# EAGLE design extension_board_0_2 (EAGLE 6.5.0)

## Sheet 1 of 4: Header
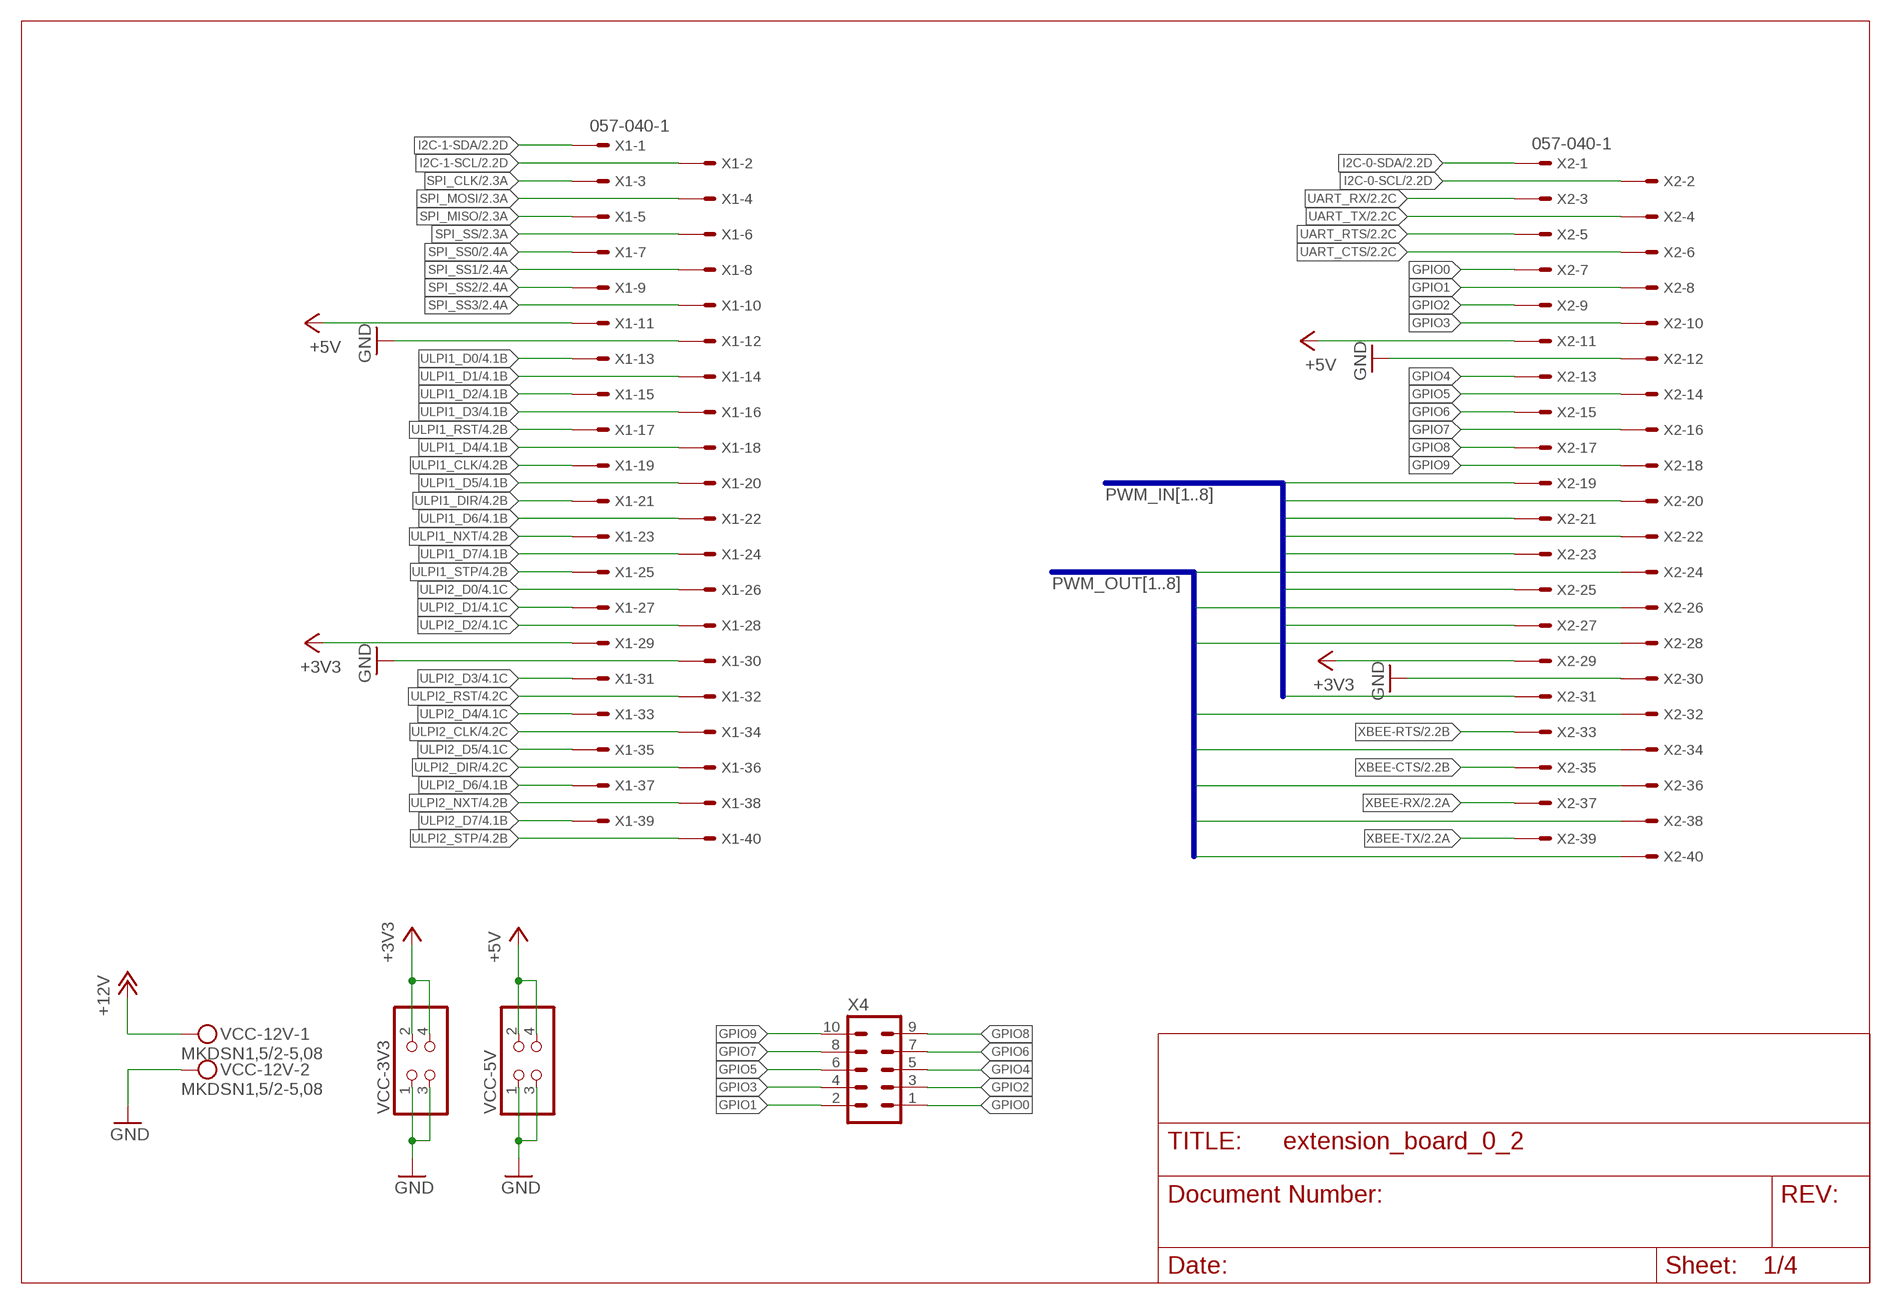
[diagram p0: schematic, sheet 1]

### Parts
VCC-3V3  PINHD-2X2  [2X02]
VCC-5V  PINHD-2X2  [2X02]
VCC-12V  MKDSN1,5/2-5,08  [MKDSN1,5/2-5,08]
X1  057-040-1  [057-040-1]
X2  057-040-1  [057-040-1]
X4  MA05-2  [MA05-2]

### Nets
+3V3: VCC-3V3.2 VCC-3V3.4 X1.29 X2.29 ; also sheet 2,4
+5V: VCC-5V.2 VCC-5V.4 X1.11 X2.11 ; also sheet 2,4
+12V: VCC-12V.1 ; also sheet 3
GND: VCC-3V3.1 VCC-3V3.3 VCC-5V.1 VCC-5V.3 VCC-12V.2 X1.12 X1.30 X2.12 X2.30 ; also sheet 2,3,4
GPIO0: X2.7 X4.1
GPIO1: X2.8 X4.2
GPIO2: X2.9 X4.3
GPIO3: X2.10 X4.4
GPIO4: X2.13 X4.5
GPIO5: X2.14 X4.6
GPIO6: X2.15 X4.7
GPIO7: X2.16 X4.8
GPIO8: X2.17 X4.9
GPIO9: X2.18 X4.10
I2C-0-SCL: X2.2 ; also sheet 2
I2C-0-SDA: X2.1 ; also sheet 2
I2C-1-SCL: X1.2 ; also sheet 2
I2C-1-SDA: X1.1 ; also sheet 2
PWM_IN1: X2.19 ; also sheet 2
PWM_IN2: X2.20 ; also sheet 2
PWM_IN3: X2.21 ; also sheet 2
PWM_IN4: X2.22 ; also sheet 2
PWM_IN5: X2.23 ; also sheet 2
PWM_IN6: X2.25 ; also sheet 2
PWM_IN7: X2.27 ; also sheet 2
PWM_IN8: X2.31 ; also sheet 2
PWM_OUT1: X2.40 ; also sheet 2
PWM_OUT2: X2.38 ; also sheet 2
PWM_OUT3: X2.36 ; also sheet 2
PWM_OUT4: X2.34 ; also sheet 2
PWM_OUT5: X2.32 ; also sheet 2
PWM_OUT6: X2.28 ; also sheet 2
PWM_OUT7: X2.26 ; also sheet 2
PWM_OUT8: X2.24 ; also sheet 2
SPI_CLK: X1.3 ; also sheet 2
SPI_MISO: X1.5 ; also sheet 2
SPI_MOSI: X1.4 ; also sheet 2
SPI_SS: X1.6 ; also sheet 2
SPI_SS0: X1.7 ; also sheet 2
SPI_SS1: X1.8 ; also sheet 2
SPI_SS2: X1.9 ; also sheet 2
SPI_SS3: X1.10 ; also sheet 2
UART_CTS: X2.6 ; also sheet 2
UART_RTS: X2.5 ; also sheet 2
UART_RX: X2.3 ; also sheet 2
UART_TX: X2.4 ; also sheet 2
ULPI1_CLK: X1.19 ; also sheet 4
ULPI1_D0: X1.13 ; also sheet 4
ULPI1_D1: X1.14 ; also sheet 4
ULPI1_D2: X1.15 ; also sheet 4
ULPI1_D3: X1.16 ; also sheet 4
ULPI1_D4: X1.18 ; also sheet 4
ULPI1_D5: X1.20 ; also sheet 4
ULPI1_D6: X1.22 ; also sheet 4
ULPI1_D7: X1.24 ; also sheet 4
ULPI1_DIR: X1.21 ; also sheet 4
ULPI1_NXT: X1.23 ; also sheet 4
ULPI1_RST: X1.17 ; also sheet 4
ULPI1_STP: X1.25 ; also sheet 4
ULPI2_CLK: X1.34 ; also sheet 4
ULPI2_D0: X1.26 ; also sheet 4
ULPI2_D1: X1.27 ; also sheet 4
ULPI2_D2: X1.28 ; also sheet 4
ULPI2_D3: X1.31 ; also sheet 4
ULPI2_D4: X1.33 ; also sheet 4
ULPI2_D5: X1.35 ; also sheet 4
ULPI2_D6: X1.37 ; also sheet 4
ULPI2_D7: X1.39 ; also sheet 4
ULPI2_DIR: X1.36 ; also sheet 4
ULPI2_NXT: X1.38 ; also sheet 4
ULPI2_RST: X1.32 ; also sheet 4
ULPI2_STP: X1.40 ; also sheet 4
XBEE-CTS: X2.35 ; also sheet 2
XBEE-RTS: X2.33 ; also sheet 2
XBEE-RX: X2.37 ; also sheet 2
XBEE-TX: X2.39 ; also sheet 2

### Buses
PWM_IN[1..8]
PWM_OUT[1..8]

## Sheet 2 of 4: Interfaces
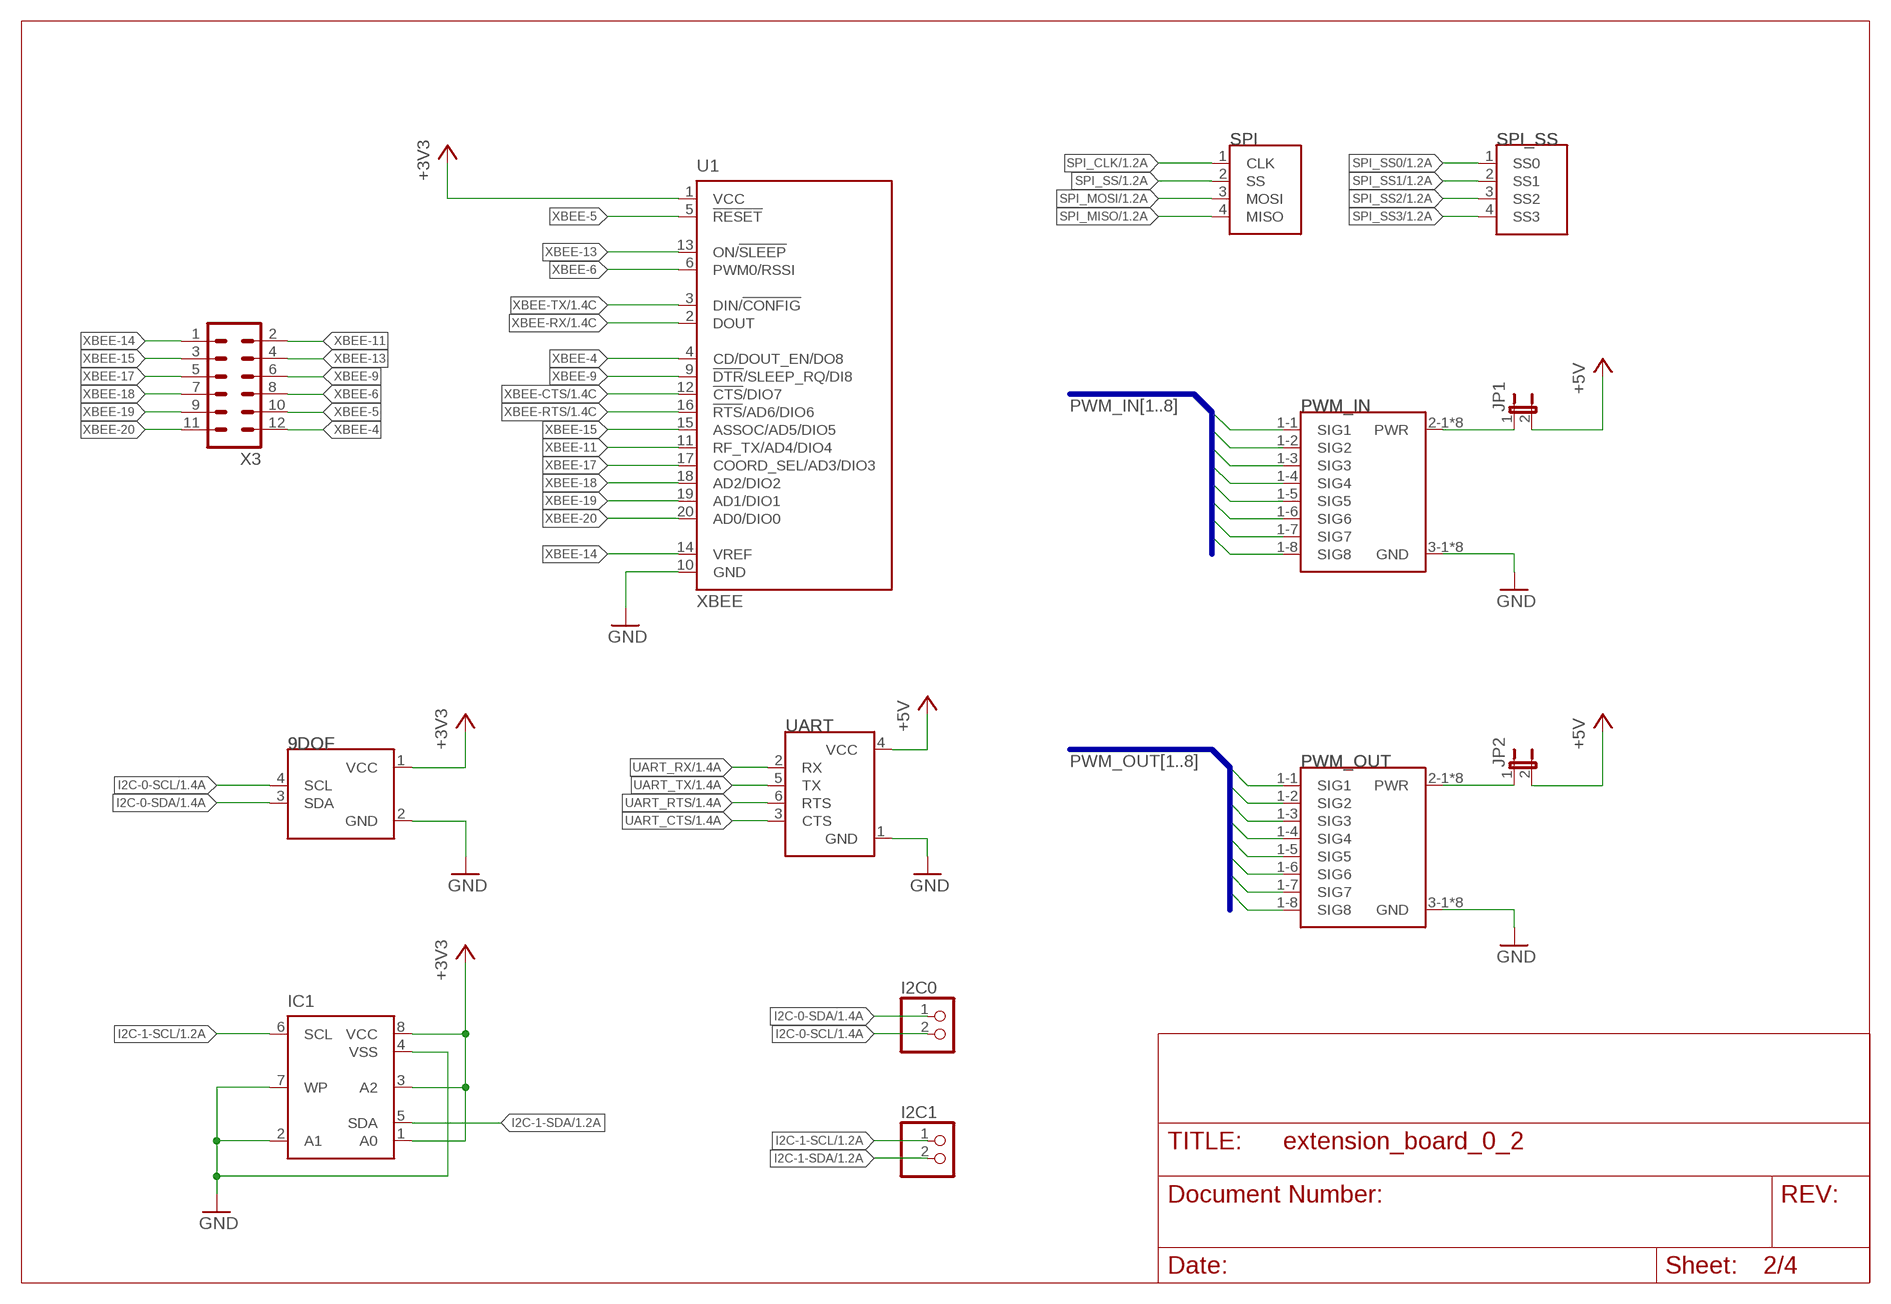
[diagram p1: schematic, sheet 2]

### Parts
9DOF  I2C  [MA04-1]
I2C0  PINHD-1X2  [1X02]
I2C1  PINHD-1X2  [1X02]
IC1  NE555  [DIL-08]
JP1  JP1E  [JP1]
JP2  JP1E  [JP1]
PWM_IN  8RX  [MA08-3]
PWM_OUT  8RX  [MA08-3]
SPI  SPI_MAIN  [MA04-1]
SPI_SS  SPI_SS  [MA04-1]
U1  XBEE  [XBEE]
UART  UART  [MA03-2]
X3  MA06-2  [MA06-2]

### Nets
+3V3: 9DOF.1(VCC) IC1.1(A0) IC1.3(A2) IC1.8(VCC) U1.1(VCC) ; also sheet 1,4
+5V: JP1.2 JP2.2 UART.4(VCC) ; also sheet 1,4
GND: 9DOF.2(GND) IC1.2(A1) IC1.4(VSS) IC1.7(WP) PWM_IN.3-1(GND) PWM_IN.3-2(GND) PWM_IN.3-3(GND) PWM_IN.3-4(GND) PWM_IN.3-5(GND) PWM_IN.3-6(GND) PWM_IN.3-7(GND) PWM_IN.3-8(GND) PWM_OUT.3-1(GND) PWM_OUT.3-2(GND) PWM_OUT.3-3(GND) PWM_OUT.3-4(GND) PWM_OUT.3-5(GND) PWM_OUT.3-6(GND) PWM_OUT.3-7(GND) PWM_OUT.3-8(GND) U1.10(GND) UART.1(GND) ; also sheet 1,3,4
I2C-0-SCL: 9DOF.4(SCL) I2C0.2 ; also sheet 1
I2C-0-SDA: 9DOF.3(SDA) I2C0.1 ; also sheet 1
I2C-1-SCL: I2C1.1 IC1.6(SCL) ; also sheet 1
I2C-1-SDA: I2C1.2 IC1.5(SDA) ; also sheet 1
N$11: JP1.1 PWM_IN.2-1(PWR) PWM_IN.2-2(PWR) PWM_IN.2-3(PWR) PWM_IN.2-4(PWR) PWM_IN.2-5(PWR) PWM_IN.2-6(PWR) PWM_IN.2-7(PWR) PWM_IN.2-8(PWR)
N$12: JP2.1 PWM_OUT.2-1(PWR) PWM_OUT.2-2(PWR) PWM_OUT.2-3(PWR) PWM_OUT.2-4(PWR) PWM_OUT.2-5(PWR) PWM_OUT.2-6(PWR) PWM_OUT.2-7(PWR) PWM_OUT.2-8(PWR)
PWM_IN1: PWM_IN.1-1(SIG1) ; also sheet 1
PWM_IN2: PWM_IN.1-2(SIG2) ; also sheet 1
PWM_IN3: PWM_IN.1-3(SIG3) ; also sheet 1
PWM_IN4: PWM_IN.1-4(SIG4) ; also sheet 1
PWM_IN5: PWM_IN.1-5(SIG5) ; also sheet 1
PWM_IN6: PWM_IN.1-6(SIG6) ; also sheet 1
PWM_IN7: PWM_IN.1-7(SIG7) ; also sheet 1
PWM_IN8: PWM_IN.1-8(SIG8) ; also sheet 1
PWM_OUT1: PWM_OUT.1-1(SIG1) ; also sheet 1
PWM_OUT2: PWM_OUT.1-2(SIG2) ; also sheet 1
PWM_OUT3: PWM_OUT.1-3(SIG3) ; also sheet 1
PWM_OUT4: PWM_OUT.1-4(SIG4) ; also sheet 1
PWM_OUT5: PWM_OUT.1-5(SIG5) ; also sheet 1
PWM_OUT6: PWM_OUT.1-6(SIG6) ; also sheet 1
PWM_OUT7: PWM_OUT.1-7(SIG7) ; also sheet 1
PWM_OUT8: PWM_OUT.1-8(SIG8) ; also sheet 1
SPI_CLK: SPI.1(CLK) ; also sheet 1
SPI_MISO: SPI.4(MISO) ; also sheet 1
SPI_MOSI: SPI.3(MOSI) ; also sheet 1
SPI_SS: SPI.2(SS) ; also sheet 1
SPI_SS0: SPI_SS.1(SS0) ; also sheet 1
SPI_SS1: SPI_SS.2(SS1) ; also sheet 1
SPI_SS2: SPI_SS.3(SS2) ; also sheet 1
SPI_SS3: SPI_SS.4(SS3) ; also sheet 1
UART_CTS: UART.3(CTS) ; also sheet 1
UART_RTS: UART.6(RTS) ; also sheet 1
UART_RX: UART.2(RX) ; also sheet 1
UART_TX: UART.5(TX) ; also sheet 1
XBEE-4: U1.4(CD/DOUT_EN/DO8) X3.12
XBEE-5: U1.5(!RESET) X3.10
XBEE-6: U1.6(PWM0/RSSI) X3.8
XBEE-9: U1.9(!DTR!/SLEEP_RQ/DI8) X3.6
XBEE-11: U1.11(RF_TX/AD4/DIO4) X3.2
XBEE-13: U1.13(ON/!SLEEP) X3.4
XBEE-14: U1.14(VREF) X3.1
XBEE-15: U1.15(ASSOC/AD5/DIO5) X3.3
XBEE-17: U1.17(COORD_SEL/AD3/DIO3) X3.5
XBEE-18: U1.18(AD2/DIO2) X3.7
XBEE-19: U1.19(AD1/DIO1) X3.9
XBEE-20: U1.20(AD0/DIO0) X3.11
XBEE-CTS: U1.12(!CTS!/DIO7) ; also sheet 1
XBEE-RTS: U1.16(!RTS!/AD6/DIO6) ; also sheet 1
XBEE-RX: U1.2(DOUT) ; also sheet 1
XBEE-TX: U1.3(DIN/!CONFIG) ; also sheet 1

### Buses
PWM_IN[1..8]
PWM_OUT[1..8]

## Sheet 3 of 4: power supply
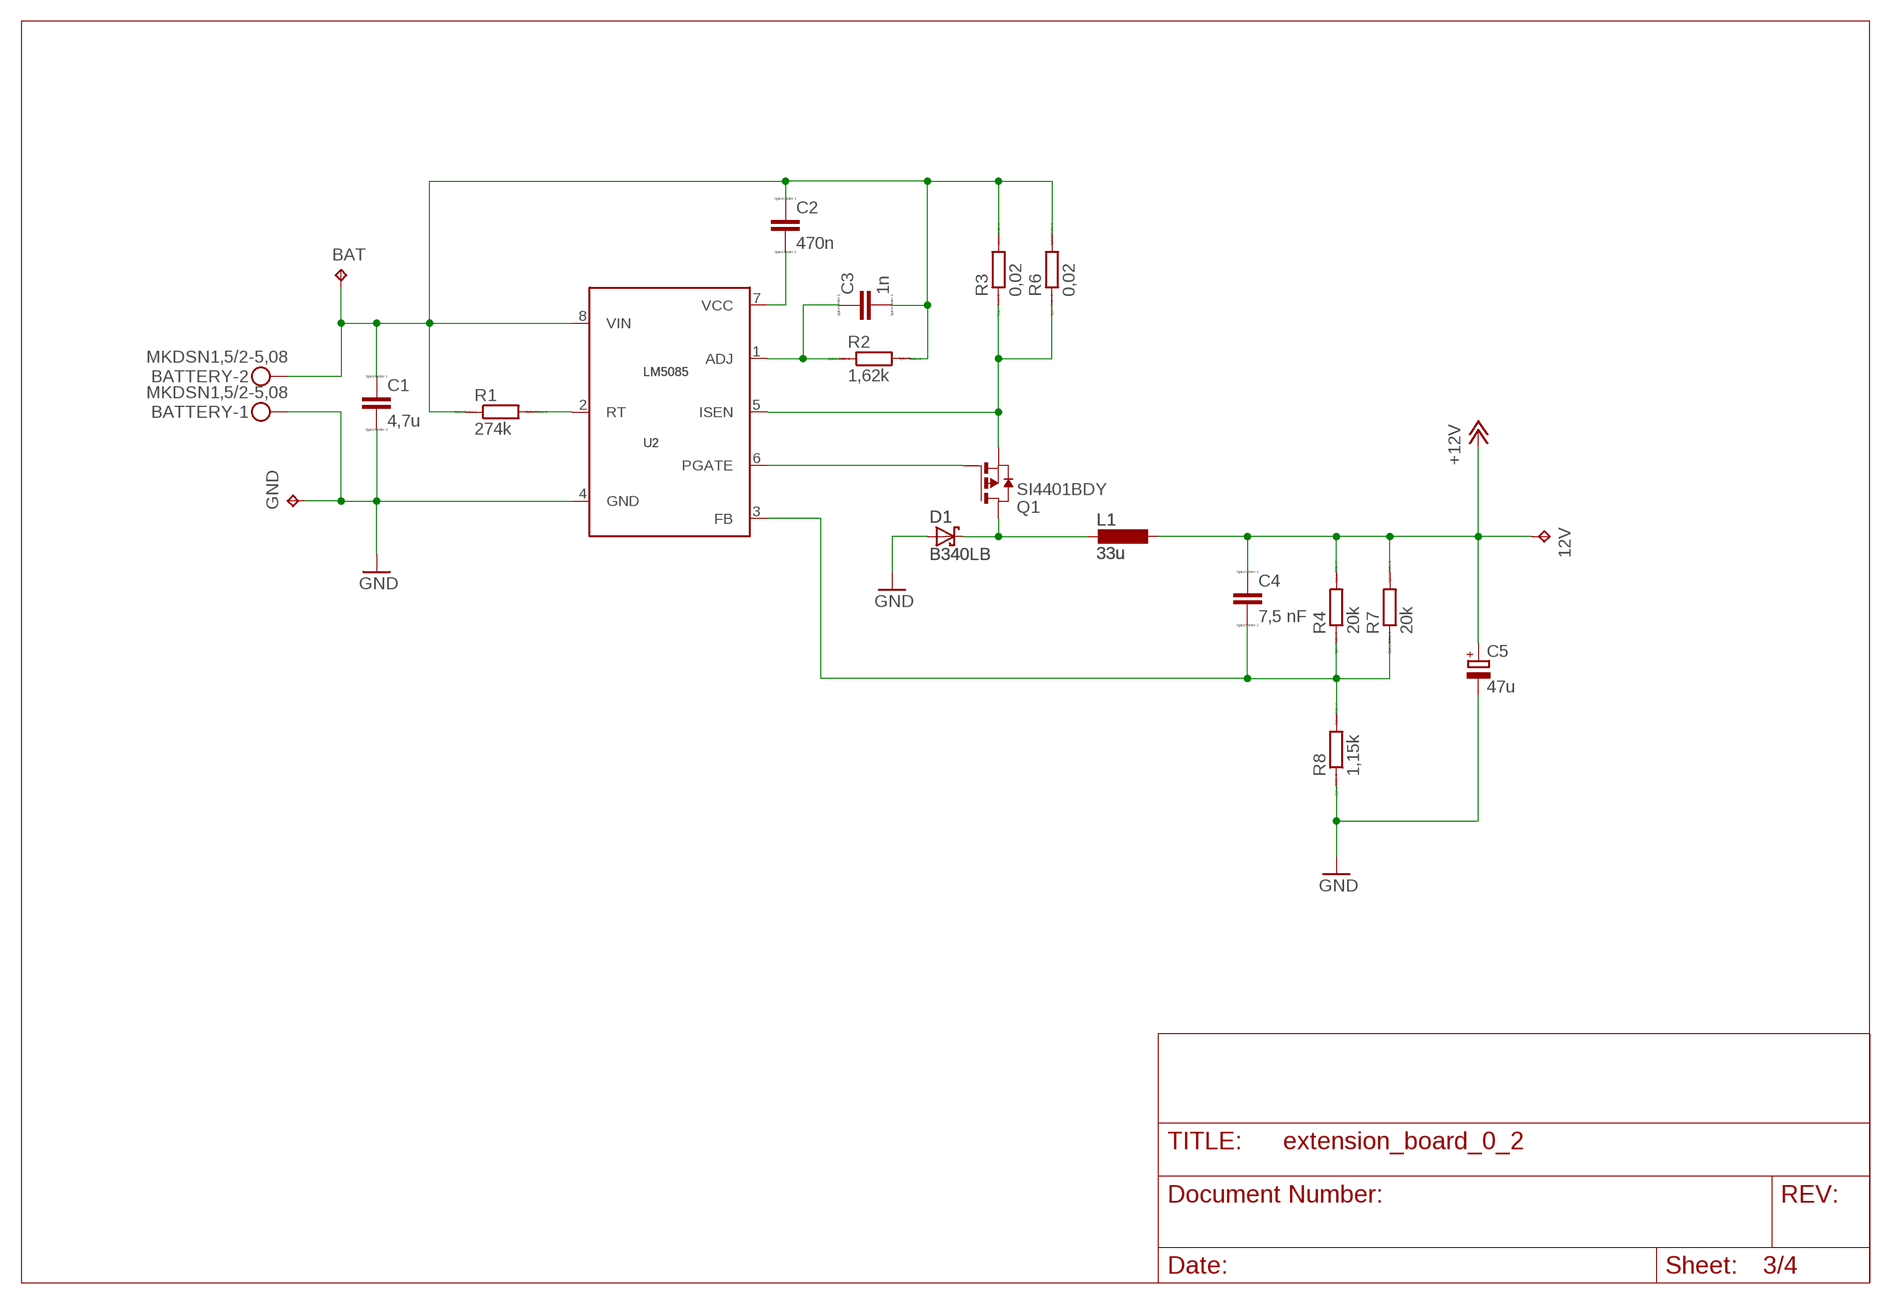
[diagram p2: schematic, sheet 3]

### Parts
12V  TPPAD1-13  [P1-13]
BAT  TPPAD1-13  [P1-13]
BATTERY  MKDSN1,5/2-5,08  [MKDSN1,5/2-5,08]
C1  4,7u  C  [C0805]
C2  470n  CC1206  [C1206]
C3  1n  CC1206  [C1206]
C4  7,5 nF  CC0603  [C0603]
C5  47u  CPOL-EUCT3216  [CT3216]
D1  B340LB  [SMB]
GND  TPPAD1-13  [P1-13]
L1  33u  MSS1210  [INDUKTOR]
Q1  SI4401BDY  [SO8-FET]
R1  274k  RR1206  [R1206]
R2  1,62k  R  [R0805]
R3  0,02  RR1206  [R1206]
R4  20k  RR1206  [R1206]
R6  0,02  RR1206  [R1206]
R7  20k  RR1206  [R1206]
R8  1,15k  R  [R0805]
U2  LM5085  [S-PDSO-G08]

### Nets
+12V: 12V.TP C4.1 C5.+ L1.P$2 R4.2 R7.2 ; also sheet 1
D: D1.C L1.P$1 Q1.5(D) Q1.6(D) Q1.7(D) Q1.8(D) Q1.D1(D) Q1.D2(D) Q1.D3(D)
G: Q1.4(G) U2.6(PGATE)
GND: BATTERY.1 C1.2 C5.- D1.A GND.TP R8.1 U2.4(GND) ; also sheet 1,2,4
N$3: R1.2 U2.2(RT)
N$4: C2.2 U2.7(VCC)
N$5: C3.1 R2.1 U2.1(ADJ)
N$8: C4.2 R4.1 R7.1 R8.2 U2.3(FB)
S: Q1.1(S) Q1.2(S) Q1.3(S) R3.1 R6.1 U2.5(ISEN)
VCC-BAT: BAT.TP BATTERY.2 C1.1 C2.1 C3.2 R1.1 R2.2 R3.2 R6.2 U2.8(VIN)

## Sheet 4 of 4: USB
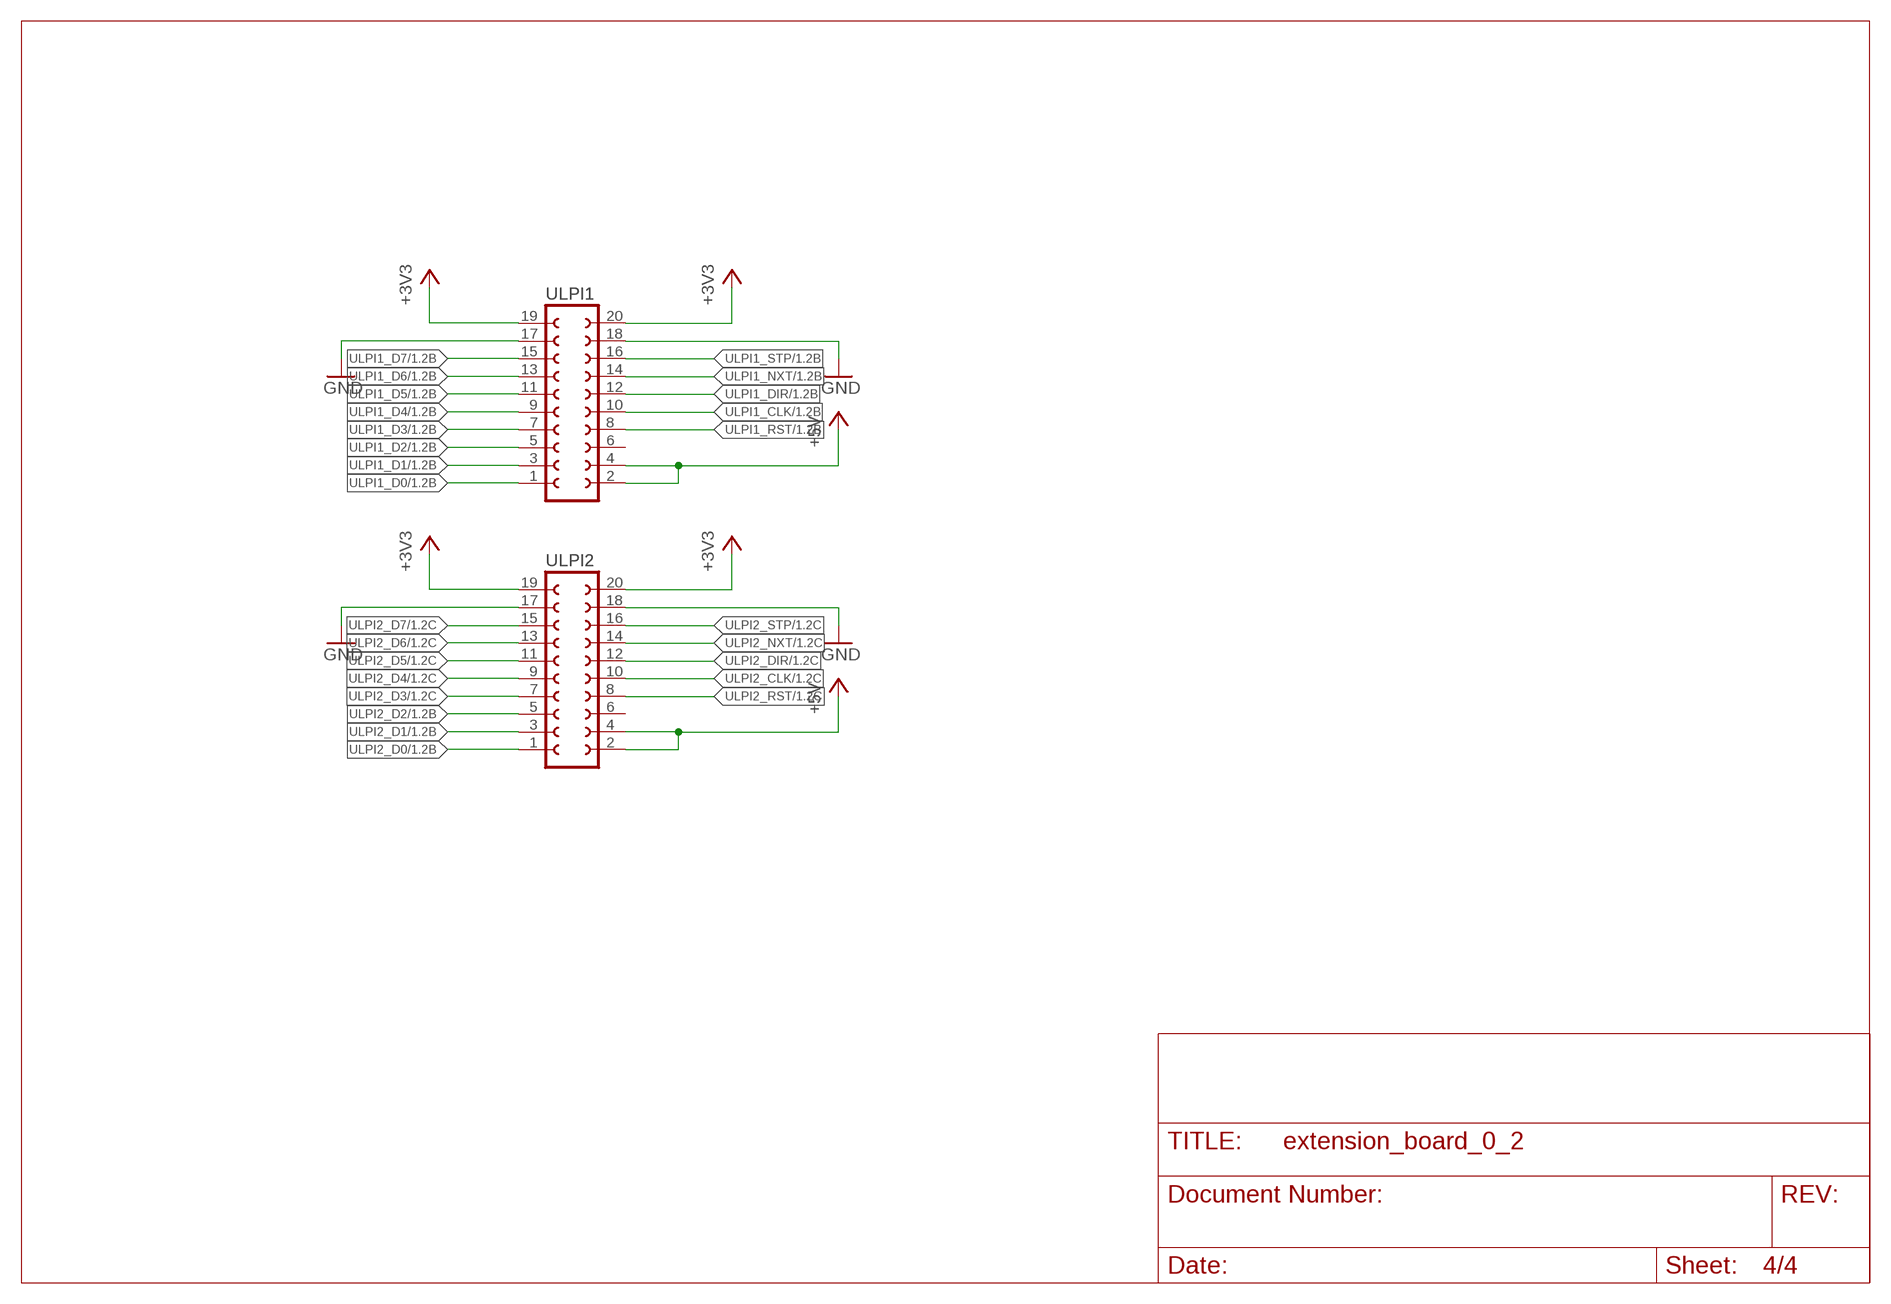
[diagram p3: schematic, sheet 4]

### Parts
ULPI1  FE10-2W  [FE10-2W]
ULPI2  FE10-2W  [FE10-2W]

### Nets
+3V3: ULPI1.19 ULPI1.20 ULPI2.19 ULPI2.20 ; also sheet 1,2
+5V: ULPI1.2 ULPI1.4 ULPI2.2 ULPI2.4 ; also sheet 1,2
GND: ULPI1.17 ULPI1.18 ULPI2.17 ULPI2.18 ; also sheet 1,2,3
ULPI1_CLK: ULPI1.10 ; also sheet 1
ULPI1_D0: ULPI1.1 ; also sheet 1
ULPI1_D1: ULPI1.3 ; also sheet 1
ULPI1_D2: ULPI1.5 ; also sheet 1
ULPI1_D3: ULPI1.7 ; also sheet 1
ULPI1_D4: ULPI1.9 ; also sheet 1
ULPI1_D5: ULPI1.11 ; also sheet 1
ULPI1_D6: ULPI1.13 ; also sheet 1
ULPI1_D7: ULPI1.15 ; also sheet 1
ULPI1_DIR: ULPI1.12 ; also sheet 1
ULPI1_NXT: ULPI1.14 ; also sheet 1
ULPI1_RST: ULPI1.8 ; also sheet 1
ULPI1_STP: ULPI1.16 ; also sheet 1
ULPI2_CLK: ULPI2.10 ; also sheet 1
ULPI2_D0: ULPI2.1 ; also sheet 1
ULPI2_D1: ULPI2.3 ; also sheet 1
ULPI2_D2: ULPI2.5 ; also sheet 1
ULPI2_D3: ULPI2.7 ; also sheet 1
ULPI2_D4: ULPI2.9 ; also sheet 1
ULPI2_D5: ULPI2.11 ; also sheet 1
ULPI2_D6: ULPI2.13 ; also sheet 1
ULPI2_D7: ULPI2.15 ; also sheet 1
ULPI2_DIR: ULPI2.12 ; also sheet 1
ULPI2_NXT: ULPI2.14 ; also sheet 1
ULPI2_RST: ULPI2.8 ; also sheet 1
ULPI2_STP: ULPI2.16 ; also sheet 1
Unconnected: ULPI1.6 ULPI2.6

## Library data of the parts
9DOF = multicopter:I2C
12V BAT GND = testpad:TP: Test pad
BATTERY VCC-12V = con-phoenix-508:MKDSN1,5/2-5,08: MKDSN 1,5/ 2-5,08 Printklemme Nennstrom: 13,5 A Nennspannung: 250 V Rastermaß: 5,08 mm Polzahl: 2 Anschlussart: Schraubanschluss Montage: Löten Anschlussrichtung Leiter/Platine: 0 ° Artikelnummer: 1729128 Source: http://eshop.phoenixcontact.com .. 1729128.pdf; MPN: MKDSN 1,5/2-5.08; OC_FARNELL: 1792903; OC_NEWARK: 30M2397
C1-C4 = eagle-ltspice:C: CAPACITOR, European symbol; SPICEMODEL: NONE; SPICEPREFIX: C
C5 = resistor:CPOL-EU: POLARIZED CAPACITOR, European symbol
D1 = multicopter:B340L: Silicon Schottky Diodes General-purpose diode for high-speed switching
I2C0 I2C1 = pinhead:PINHD-1X2: PIN HEADER
IC1 = solar:NE555: General purpose bipolar Timer
JP1 JP2 = jumper:JP1E: JUMPER
L1 = multicopter:MSS1210
PWM_IN PWM_OUT = multicopter:8RX
Q1 = probox-parts:SI4401BDY
R1-R4 R6-R8 = eagle-ltspice:R: RESISTOR, European symbol; SPICEMODEL: NONE; SPICEPREFIX: R
SPI = multicopter:SPI_MAIN
SPI_SS = multicopter:SPI_SS
U1 = maxstream:XBEE: XBee (TM) /XBee-PRO(TM) OEM RF Modules Source: MaxStream, Inc. xbee_productmanual.pdf; MPN: XBP24-Z7UIT-004; OC_FARNELL: 1751799; OC_NEWARK: 34R5507
U2 = multicopter:LM5085: LM5085 http://www.ti.com/lit/ds/symlink/lm5085.pdf
UART = multicopter:UART
ULPI1 ULPI2 = multicopter:FE10-2W: FEMALE HEADER; OC_FARNELL: unknown; OC_NEWARK: unknown
VCC-3V3 VCC-5V = pinhead:PINHD-2X2: PIN HEADER
X1 X2 = con-panduit:057-040-: CONNECTOR 40-pin series 057 contact pc board low profile headers; OC_FARNELL: unknown; OC_NEWARK: unknown
X3 = con-lstb:MA06-2: PIN HEADER; OC_FARNELL: unknown; OC_NEWARK: unknown
X4 = con-lstb:MA05-2: PIN HEADER; OC_FARNELL: unknown; OC_NEWARK: unknown

## Board
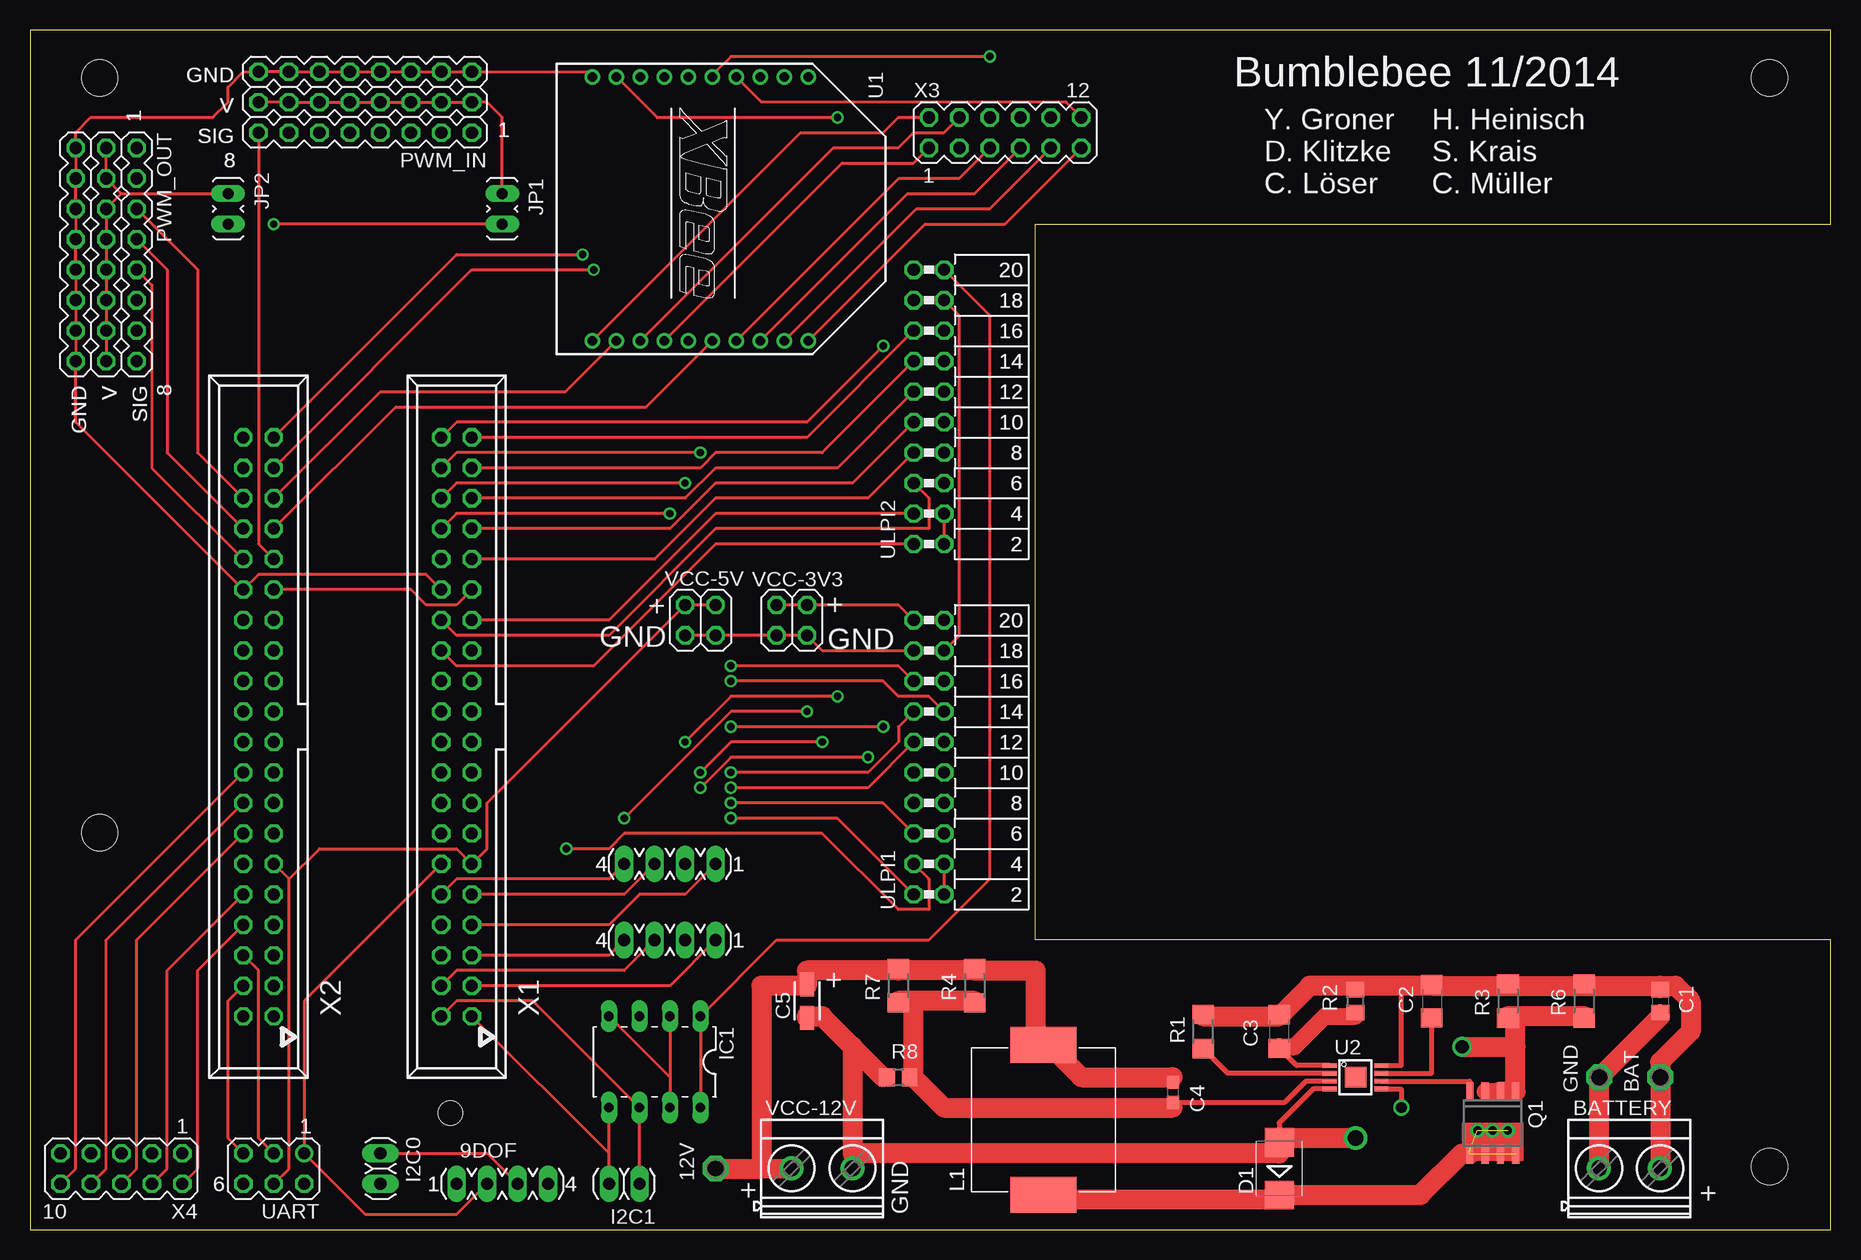
[diagram p4: board, top side]
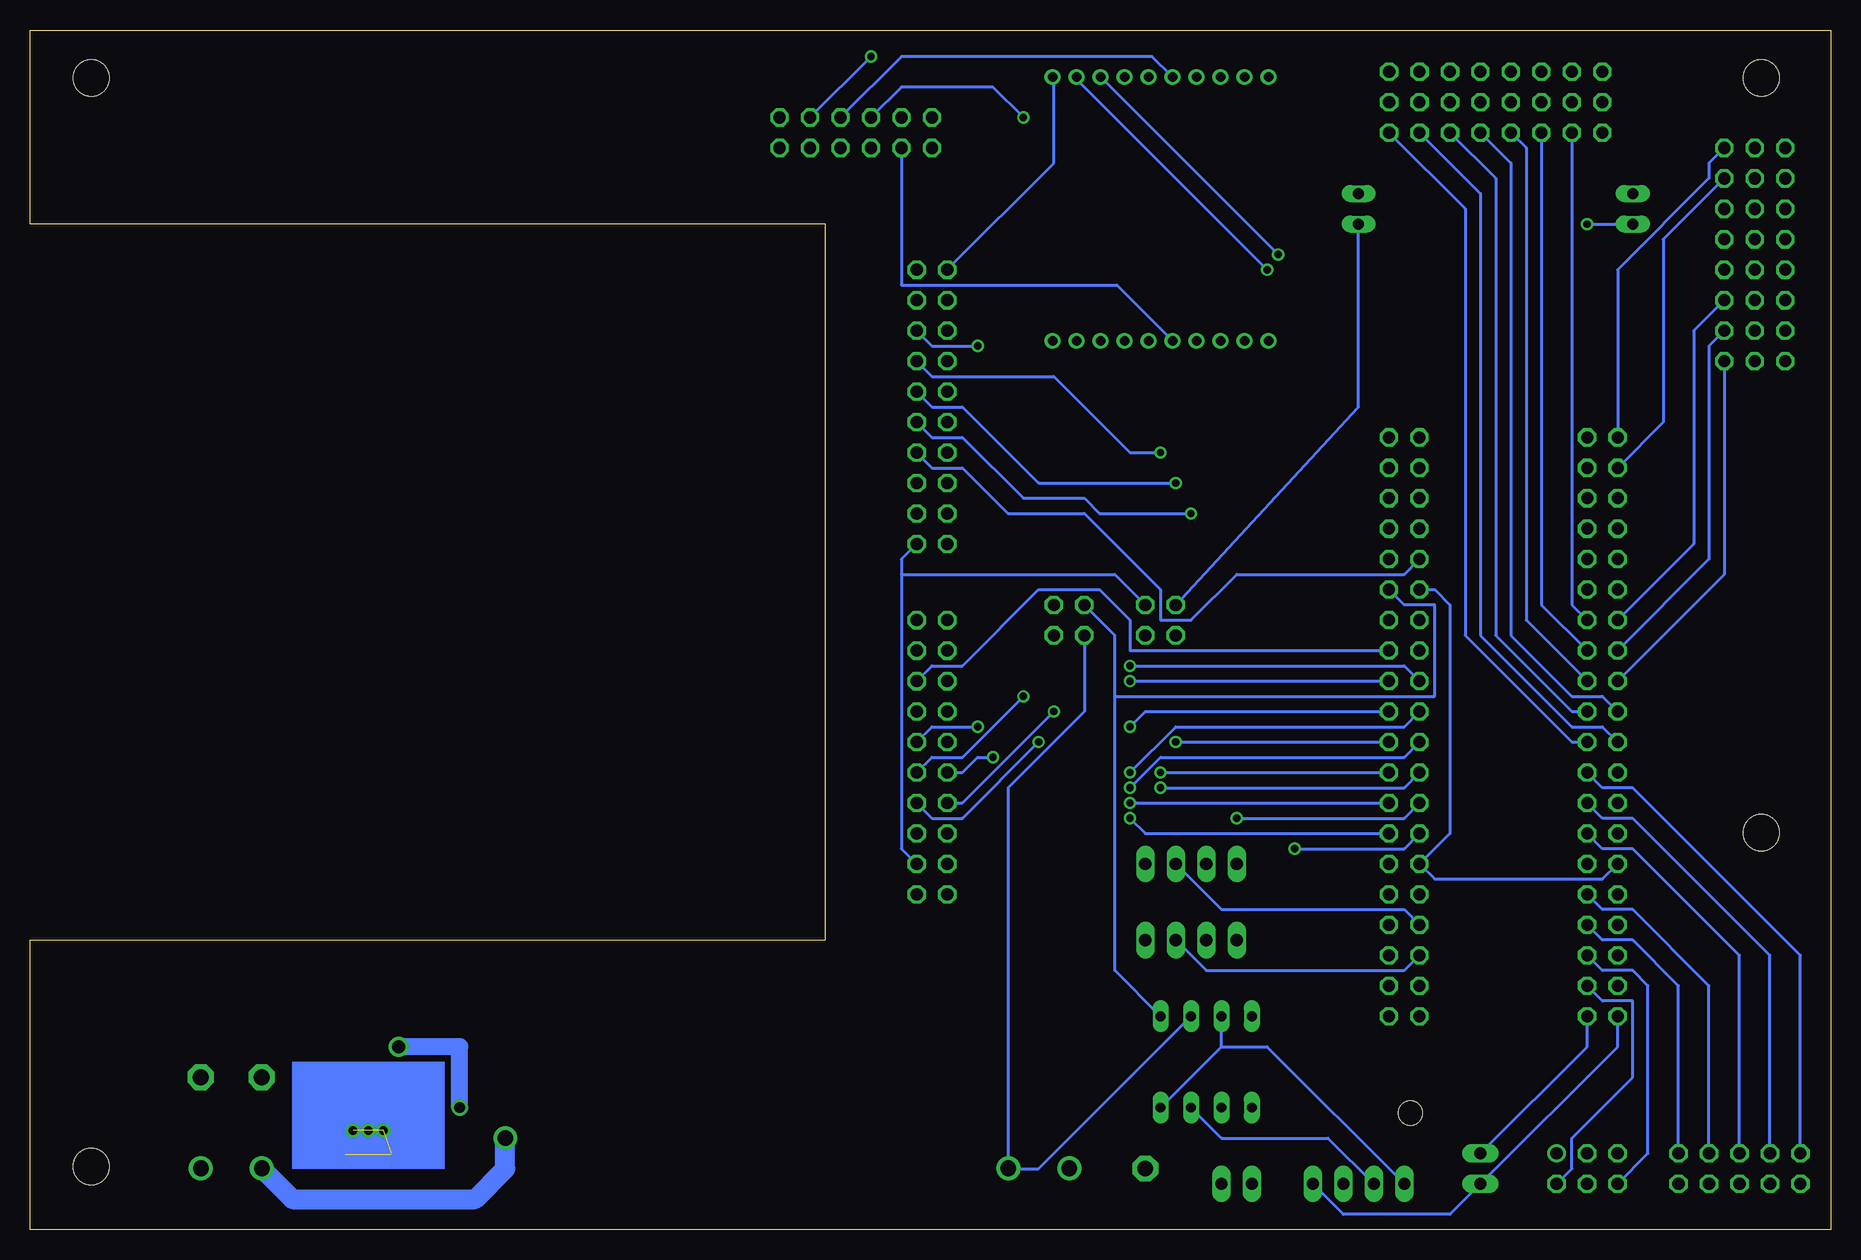
[diagram p5: board, bottom side, seen from below]

Size 150.11 x 100 mm. Coordinates in mm from the lower left corner, seen from the top.
Outline: 0,0 150.11,0 150.11,24.13 83.82,24.13 83.82,83.82 150.11,83.82 150.11,100 0,100 0,0
Copper layers (1*16): Top 0.035mm / dielectric 1.5mm / Bottom 0.035mm
Design rules "default *": minimum track width 10mil, minimum drill 24mil, track to track 8mil, track to pad 8mil, pad to pad 8mil, via to via 8mil, smd to smd 8mil, copper to edge 40mil, drill to drill 8mil, minimum pad ring 10mil, minimum via ring 8mil, stop-mask expansion 3mil, vias tented up to drill 0mil, thermal gap 10mil
Holes 3 mm at 5.8,96 5.8,33.08 145,96 145,5.25
Holes 2 mm at 35.04,9.71

### Footprints (pad centres in the part's own frame; a part is rotated, then mirrored left to right if it is on the bottom)
MA04-1 = drill 1.016 long: 1 -3.81,0; 2 -1.27,0; 3 1.27,0; 4 3.81,0
P1-13 = drill 1.321 pad 2.159 octagon: TP 0,0
MKDSN1,5/2-5,08 = drill 1.3 pad 2: 1 -2.561,0.025; 2 2.519,0.025
C0805 = smd 1.3 x 1.5: 1 -0.95,0; 2 0.95,0
C1206 = smd 1.6 x 1.8: 1 -1.4,0; 2 1.4,0
C0603 = smd 1.1 x 1: 1 -0.85,0; 2 0.85,0
CT3216 = smd 2 x 1.2: + 1.4,0; - -1.4,0
SMB = smd 2.4 x 2.4: A 2.2,0; C -2.2,0
1X02 = drill 1.016 long: 1 -1.27,0; 2 1.27,0
DIL-08 = drill 0.813 long: 1 -3.81,-3.81; 2 -1.27,-3.81; 3 1.27,-3.81; 4 3.81,-3.81; 5 3.81,3.81; 6 1.27,3.81; 7 -1.27,3.81; 8 -3.81,3.81
JP1 = drill 0.914 long: 1 0,-1.27; 2 0,1.27
INDUKTOR = smd 5.5 x 3: P$1 6,-0.25; P$2 6,12.25
MA08-3 = drill 1.016 octagon: 1-1 -8.89,5.08; 1-2 -6.35,5.08; 1-3 -3.81,5.08; 1-4 -1.27,5.08; 1-5 1.27,5.08; 1-6 3.81,5.08; 1-7 6.35,5.08; 1-8 8.89,5.08; 2-1 -8.89,2.54; 2-2 -6.35,2.54; 2-3 -3.81,2.54; 2-4 -1.27,2.54; 2-5 1.27,2.54; 2-6 3.81,2.54; 2-7 6.35,2.54; 2-8 8.89,2.54; 3-1 -8.89,0; 3-2 -6.35,0; 3-3 -3.81,0; 3-4 -1.27,0; 3-5 1.27,0; 3-6 3.81,0; 3-7 6.35,0; 3-8 8.89,0
SO8-FET = smd 0.6 x 1.6: 1 -1.905,-2.6; 2 -0.635,-2.6; 3 0.635,-2.6; 4 1.905,-2.6; 5 1.905,2.6; 6 0.635,2.6; 7 -0.635,2.6; 8 -1.905,2.6 | drill 0.7: D1 -1.27,0.635; D2 0,0.635; D3 1.27,0.635
R1206 = smd 1.6 x 1.803: 1 -1.422,0; 2 1.422,0
R0805 = smd 1.3 x 1.5: 1 -0.95,0; 2 0.95,0
XBEE = drill 0.8 pad 1.27: 1 -11,9; 2 -11,7; 3 -11,5; 4 -11,3; 5 -11,1; 6 -11,-1; 7 -11,-3; 8 -11,-5; 9 -11,-7; 10 -11,-9; 11 11,-9; 12 11,-7; 13 11,-5; 14 11,-3; 15 11,-1; 16 11,1; 17 11,3; 18 11,5; 19 11,7; 20 11,9
S-PDSO-G08 = smd 0.4 x 1.2: 1 -0.975,-2.157; 2 -0.325,-2.157; 3 0.325,-2.157; 4 0.975,-2.157; 5 0.975,2.157; 6 0.325,2.157; 7 -0.325,2.157; 8 -0.975,2.157 | smd 1.73 x 1.78: TH 0,0
MA03-2 = drill 1.016: 1 -2.54,-1.27 | drill 1.016 octagon: 2 -2.54,1.27; 3 0,-1.27; 4 0,1.27; 5 2.54,-1.27; 6 2.54,1.27
FE10-2W = drill 1.016 octagon: 1 -11.43,1.27; 2 -11.43,-1.27; 3 -8.89,1.27; 4 -8.89,-1.27; 5 -6.35,1.27; 6 -6.35,-1.27; 7 -3.81,1.27; 8 -3.81,-1.27; 9 -1.27,1.27; 10 -1.27,-1.27; 11 1.27,1.27; 12 1.27,-1.27; 13 3.81,1.27; 14 3.81,-1.27; 15 6.35,1.27; 16 6.35,-1.27; 17 8.89,1.27; 18 8.89,-1.27; 19 11.43,1.27; 20 11.43,-1.27
2X02 = drill 1.016 octagon: 1 -1.27,-1.27; 2 -1.27,1.27; 3 1.27,-1.27; 4 1.27,1.27
057-040-1 = drill 1 octagon: 1 -24.13,-1.27; 2 -24.13,1.27; 3 -21.59,-1.27; 4 -21.59,1.27; 5 -19.05,-1.27; 6 -19.05,1.27; 7 -16.51,-1.27; 8 -16.51,1.27; 9 -13.97,-1.27; 10 -13.97,1.27; 11 -11.43,-1.27; 12 -11.43,1.27; 13 -8.89,-1.27; 14 -8.89,1.27; 15 -6.35,-1.27; 16 -6.35,1.27; 17 -3.81,-1.27; 18 -3.81,1.27; 19 -1.27,-1.27; 20 -1.27,1.27; 21 1.27,-1.27; 22 1.27,1.27; 23 3.81,-1.27; 24 3.81,1.27; 25 6.35,-1.27; 26 6.35,1.27; 27 8.89,-1.27; 28 8.89,1.27; 29 11.43,-1.27; 30 11.43,1.27; 31 13.97,-1.27; 32 13.97,1.27; 33 16.51,-1.27; 34 16.51,1.27; 35 19.05,-1.27; 36 19.05,1.27; 37 21.59,-1.27; 38 21.59,1.27; 39 24.13,-1.27; 40 24.13,1.27
MA06-2 = drill 1.016 octagon: 1 -6.35,-1.27; 2 -6.35,1.27; 3 -3.81,-1.27; 4 -3.81,1.27; 5 -1.27,-1.27; 6 -1.27,1.27; 7 1.27,-1.27; 8 1.27,1.27; 9 3.81,-1.27; 10 3.81,1.27; 11 6.35,-1.27; 12 6.35,1.27
MA05-2 = drill 1.016 octagon: 1 -5.08,-1.27; 2 -5.08,1.27; 3 -2.54,-1.27; 4 -2.54,1.27; 5 0,-1.27; 6 0,1.27; 7 2.54,-1.27; 8 2.54,1.27; 9 5.08,-1.27; 10 5.08,1.27

### Placement (x,y rotation side)
9DOF  39.37,3.81 0 top
12V  57.15,5.08 90 top
BAT  135.89,12.7 90 top
BATTERY  133.35,5.08 0 top
C1  135.89,19.05 270 top
C2  116.84,19.05 270 top
C3  104.14,16.51 90 top
C4  95.25,11.43 270 top
C5  64.77,19.05 90 top
D1  104.14,5.08 90 top
GND  130.81,12.7 90 top
I2C0  29.21,5.08 270 top
I2C1  49.53,3.81 180 top
IC1  52.07,13.97 180 top
JP1  39.37,85.09 180 top
JP2  16.51,85.09 180 top
L1  78.49,3.15 0 top
PWM_IN  27.94,96.52 180 top
PWM_OUT  3.81,81.28 270 top
Q1  121.92,8.89 180 top
R1  97.79,16.51 270 top
R2  110.49,19.05 90 top
R3  123.19,19.05 90 top
R4  78.74,20.32 90 top
R6  129.54,19.05 90 top
R7  72.39,20.32 90 top
R8  72.39,12.7 0 top
SPI  53.34,24.13 180 top
SPI_SS  53.34,30.48 180 top
U1  55.88,85.09 270 top
U2  110.49,12.7 270 top
UART  20.32,5.08 180 top
ULPI1  74.93,39.37 90 top
ULPI2  74.93,68.58 90 top
VCC-3V3  63.5,50.8 0 top
VCC-5V  55.88,50.8 0 top
VCC-12V  66.04,5.08 0 top
X1  35.56,41.91 90 top
X2  19.05,41.91 90 top
X3  81.28,91.44 0 top
X4  7.62,5.08 180 top

### Tracks (layer width: path | path; a pad name or v marks a point on that pad's centre or on a via)
+3V3
  Top 0.254: ULPI2.19 ULPI2.20 80.01,76.2 80.01,29.21 74.93,24.13 62.23,24.13 IC1.1 IC1.8 | VCC-3V3.2 VCC-3V3.4 72.39,52.07 ULPI1.19 ULPI1.20 | X2.29 31.75,53.34 33.02,52.07 35.56,52.07 X1.29
  Bottom 0.254: ULPI2.19 64.77,88.9 64.77,96.52 U1.1 | 50.8,15.24 IC1.3 | IC1.8 50.8,15.24 | 9DOF.1 46.99,15.24 50.8,15.24 | VCC-3V3.2 59.69,49.53 59.69,44.45 | 59.69,44.45 59.69,21.59 IC1.1 | X1.29 35.56,52.07 33.02,52.07 33.02,44.45 59.69,44.45
+5V  (via drill 0.61)
  Top 0.254: 21.59,29.21 X2.11 | 21.59,29.21 21.59,5.08 UART.4 | 21.59,29.21 24.13,31.75 35.56,31.75 X1.11 38.1,31.75 38.1,35.56 VCC-5V.2 VCC-5V.4 | ULPI1.4 ULPI1.2 | ULPI2.4 ULPI2.2 | JP1.2 v20.32,83.82
  Bottom 0.254: ULPI1.4 77.47,31.75 77.47,54.61 | 77.47,54.61 77.47,55.88 ULPI2.2 | VCC-5V.4 59.69,54.61 77.47,54.61 | JP1.2 39.37,68.58 VCC-5V.2 | v20.32,83.82 JP2.2
+12V
  Top 0.254: 72.39,21.59 R7.2 | 64.77,20.32 C5.+ | 78.74,21.59 R4.2 | 95.25,12.7 C4.1 | 85.09,15.24 L1.P$2
  Top 1.676: 12V.TP 60.96,5.08 | 60.96,5.08 60.96,20.32 64.77,20.32 64.77,21.59 72.39,21.59 78.74,21.59 83.82,21.59 83.82,16.51 L1.P$2 | 60.96,5.08 VCC-12V.1 | 95.25,12.7 87.63,12.7 85.09,15.24
D  (6 unrouted)
  Top 0.254: 104.14,2.54 D1.C | 85.09,2.54 L1.P$1
  Top 0.406: 119.38,6.35 119.95,6.35
  Top 1.676: 85.09,2.54 104.14,2.54 | D1.C 115.91,2.88 119.38,6.35 | 119.95,6.35 Q1.5
G
  Top 0.406: U2.6 120.02,12.38 Q1.4
GND  (via drill 1.3)
  Top 0.254: IC1.2 53.34,12.7 | 53.34,12.7 IC1.7 | 53.34,12.7 IC1.4 | 71.12,12.7 R8.1 | 68.58,5.08 VCC-12V.2 | ULPI2.17 ULPI2.18 77.47,76.2 77.47,49.53 ULPI1.18 ULPI1.17 66.04,48.26 VCC-3V3.3 VCC-3V3.1 VCC-5V.3 VCC-5V.1 | X1.12 22.86,19.05 UART.1 27.94,1.27 35.56,1.27 9DOF.2 | X1.30 33.02,54.61 19.05,54.61 X2.30 3.81,67.31 PWM_OUT.3-8 PWM_OUT.3-7 PWM_OUT.3-6 PWM_OUT.3-5 PWM_OUT.3-4 PWM_OUT.3-3 PWM_OUT.3-2 PWM_OUT.3-1 3.81,91.44 5.08,92.71 15.24,92.71 16.51,93.98 16.51,95.25 17.78,96.52 PWM_IN.3-8 PWM_IN.3-7 PWM_IN.3-6 PWM_IN.3-5 PWM_IN.3-4 PWM_IN.3-3 PWM_IN.3-2 PWM_IN.3-1 46.45,96.52 U1.10
  Top 0.406: U2.4 106.97,11.72 104.14,8.89 104.14,7.62
  Top 1.422: 68.58,6.35 68.58,5.08 | 135.89,17.78 C1.2 | 104.14,7.62 D1.A | BATTERY.1 130.81,5.13
  Top 1.676: 68.58,15.24 66.04,17.78 64.77,17.78 C5.- | 68.58,15.24 71.12,12.7 | 68.58,15.24 68.58,6.35 104.14,6.35 D1.A | 135.89,17.78 GND.TP 130.81,5.13 | v110.49,7.62 104.14,7.62
  Bottom 0.254: 9DOF.2 41.91,7.62 50.8,7.62 IC1.7 | IC1.2 66.04,5.08 68.58,5.08 | X2.12 19.05,29.21 33.02,29.21 X1.12 31.75,33.02 31.75,52.07 33.02,53.34 X1.30 | 68.58,5.08 68.58,36.83 62.23,43.18 VCC-3V3.1 | 68.58,5.08 VCC-12V.2
  Bottom 1.676: BATTERY.1 128.22,2.54 113.03,2.54 110.49,5.08 v110.49,7.62
GPIO0
  Bottom 0.254: X2.7 19.05,24.13 16.51,24.13 12.7,20.32 X4.1
GPIO1
  Top 0.254: X2.8 13.97,21.59 13.97,5.08 X4.2
GPIO2
  Bottom 0.254: X2.9 19.05,26.67 16.51,26.67 10.16,20.32 X4.3
GPIO3
  Top 0.254: X2.10 11.43,21.59 11.43,5.08 X4.4
GPIO4
  Bottom 0.254: X2.13 19.05,31.75 16.51,31.75 7.62,22.86 X4.5
GPIO5
  Top 0.254: X2.14 8.89,24.13 8.89,5.08 X4.6
GPIO6
  Bottom 0.254: X2.15 19.05,34.29 16.51,34.29 5.08,22.86 X4.7
GPIO7
  Top 0.254: X2.16 6.35,24.13 6.35,5.08 X4.8
GPIO8
  Bottom 0.254: X2.17 19.05,36.83 16.51,36.83 2.54,22.86 X4.9
GPIO9
  Top 0.254: X2.18 3.81,24.13 3.81,5.08 X4.10
I2C-0-SCL
  Bottom 0.254: X2.2 17.78,15.24 I2C0.2 31.75,1.27 40.64,1.27 9DOF.4
I2C-0-SDA
  Top 0.254: 9DOF.3 38.1,6.35 I2C0.1
  Bottom 0.254: X2.1 20.32,15.24 I2C0.1
I2C-1-SCL
  Top 0.254: I2C1.1 IC1.6 41.91,19.05 35.56,19.05 X1.2
I2C-1-SDA
  Top 0.254: I2C1.2 48.26,6.35 | 48.26,6.35 IC1.5 | 48.26,6.35 X1.1
N$3
  Top 0.406: U2.2 99.85,13.03 R1.2
N$4
  Top 0.406: U2.7 116.84,13.03 C2.2
N$5
  Top 0.254: 110.49,17.78 R2.1 | 104.14,15.24 C3.1
  Top 0.406: U2.1 105.58,13.68 C3.1
  Top 1.422: 110.49,17.78 107.95,17.78 105.41,15.24 104.14,15.24
N$8
  Top 0.254: 72.39,19.05 R7.1 | 95.25,10.16 C4.2 | 73.66,12.7 R8.2
  Top 0.406: U2.3 106.36,12.38 104.56,10.58 C4.2
  Top 1.676: 73.66,19.05 78.74,19.05 R4.1 | 73.66,19.05 72.39,19.05 | 95.25,10.16 76.2,10.16 73.66,12.7 73.66,19.05
N$11
  Top 0.254: PWM_IN.2-8 PWM_IN.2-7 PWM_IN.2-6 PWM_IN.2-5 PWM_IN.2-4 PWM_IN.2-3 PWM_IN.2-2 PWM_IN.2-1 38.1,93.98 39.37,92.71 JP1.1
N$12
  Top 0.254: PWM_OUT.2-8 PWM_OUT.2-7 PWM_OUT.2-6 PWM_OUT.2-5 PWM_OUT.2-4 PWM_OUT.2-3 7.62,86.36 | 7.62,86.36 JP2.1 | 7.62,86.36 PWM_OUT.2-2 PWM_OUT.2-1
PWM_IN1
  Bottom 0.254: X2.19 21.59,40.64 30.48,49.53 30.48,85.09 PWM_IN.1-1
PWM_IN2
  Bottom 0.254: X2.20 19.05,41.91 21.59,41.91 29.21,49.53 29.21,86.36 PWM_IN.1-2
PWM_IN3
  Bottom 0.254: X2.21 21.59,43.18 27.94,49.53 27.94,87.63 PWM_IN.1-3
PWM_IN4
  Bottom 0.254: X2.22 19.05,44.45 21.59,44.45 26.67,49.53 26.67,88.9 PWM_IN.1-4
PWM_IN5
  Bottom 0.254: X2.23 25.4,50.8 25.4,90.17 PWM_IN.1-5
PWM_IN6
  Bottom 0.254: X2.25 24.13,52.07 PWM_IN.1-6
PWM_IN7
  Bottom 0.254: X2.27 21.59,52.07 PWM_IN.1-7
PWM_IN8
  Top 0.254: X2.31 19.05,57.15 PWM_IN.1-8
PWM_OUT1
  Bottom 0.254: X2.40 17.78,80.01 10.16,87.63 10.16,88.9 PWM_OUT.1-1
PWM_OUT2
  Bottom 0.254: X2.38 13.97,67.31 13.97,82.55 PWM_OUT.1-2
PWM_OUT3
  Top 0.254: X2.36 13.97,64.77 13.97,80.01 PWM_OUT.1-3
PWM_OUT4
  Top 0.254: X2.34 11.43,64.77 11.43,80.01 PWM_OUT.1-4
PWM_OUT5
  Top 0.254: X2.32 10.16,63.5 10.16,78.74 PWM_OUT.1-5
PWM_OUT6
  Bottom 0.254: X2.28 11.43,57.15 11.43,74.93 PWM_OUT.1-6
PWM_OUT7
  Bottom 0.254: X2.26 10.16,55.88 10.16,73.66 PWM_OUT.1-7
PWM_OUT8
  Bottom 0.254: X2.24 8.89,54.61 PWM_OUT.1-8
S  (via drill 0.9, 1.1)
  Top 0.406: U2.5 114.3,11.72 v114.3,10.16
  Top 1.422: Q1.2 Q1.3
  Top 1.676: R6.1 129.54,17.78 123.19,17.78 R3.1 123.83,17.63 123.83,15.24 | 123.83,15.24 Q1.1 Q1.2 | v119.38,15.24 123.83,15.24
  Bottom 1.422: v114.3,10.16 114.3,15.24 v119.38,15.24
SPI_CLK
  Top 0.254: X1.3 53.34,20.32 SPI.1
SPI_MISO
  Top 0.254: X1.5 48.26,22.86 SPI.4
SPI_MOSI
  Top 0.254: X1.4 35.56,21.59 49.53,21.59 SPI.3
SPI_SS
  Bottom 0.254: X1.6 35.56,21.59 52.07,21.59 SPI.2
SPI_SS0
  Top 0.254: X1.7 48.26,25.4 50.8,27.94 54.61,27.94 SPI_SS.1
SPI_SS1
  Bottom 0.254: X1.8 35.56,26.67 50.8,26.67 SPI_SS.2
SPI_SS2
  Top 0.254: X1.9 49.53,27.94 SPI_SS.3
SPI_SS3
  Top 0.254: X1.10 35.56,29.21 48.26,29.21 SPI_SS.4
UART_CTS
  Top 0.254: X2.6 19.05,21.59 19.05,7.62 UART.3
UART_RTS
  Bottom 0.254: X2.5 19.05,21.59 16.51,21.59 15.24,20.32 15.24,6.35 UART.6
UART_RX
  Bottom 0.254: X2.3 19.05,19.05 16.51,19.05 16.51,12.7 21.59,7.62 21.59,5.08 UART.2
UART_TX
  Top 0.254: X2.4 16.51,19.05 16.51,7.62 UART.5
ULPI1_CLK  (via drill 0.61)
  Top 0.254: v54.61,40.64 58.42,44.45 v67.31,44.45
  Bottom 0.254: v54.61,40.64 X1.19 | v67.31,44.45 72.39,39.37 74.93,39.37 ULPI1.10
ULPI1_D0  (via drill 0.61)
  Top 0.254: v58.42,34.29 67.31,34.29 ULPI1.1
  Bottom 0.254: X1.13 57.15,33.02 v58.42,34.29
ULPI1_D1  (via drill 0.61)
  Top 0.254: v44.7,31.75 48.26,31.75 49.53,33.02 66.04,33.02 72.39,26.67 74.93,26.67 74.93,29.21 ULPI1.3
  Bottom 0.254: X1.14 35.56,31.75 v44.7,31.75
ULPI1_D2  (via drill 0.61)
  Top 0.254: v58.42,35.56 71.12,35.56 ULPI1.5
  Bottom 0.254: v58.42,35.56 X1.15
ULPI1_D3  (via drill 0.61)
  Top 0.254: v49.53,34.29 58.42,43.18 v64.77,43.18
  Bottom 0.254: X1.16 35.56,34.29 v49.53,34.29 | v64.77,43.18 72.39,35.56 ULPI1.7
ULPI1_D4  (via drill 0.61)
  Top 0.254: v55.88,36.83 58.42,39.37 v69.85,39.37
  Bottom 0.254: X1.18 35.56,36.83 v55.88,36.83 | v69.85,39.37 71.12,39.37 72.39,38.1 ULPI1.9
ULPI1_D5  (via drill 0.61)
  Top 0.254: v58.42,36.83 69.85,36.83 ULPI1.11
  Bottom 0.254: X1.20 35.56,39.37 55.88,39.37 v58.42,36.83
ULPI1_D6  (via drill 0.61)
  Top 0.254: v58.42,38.1 69.85,38.1 72.39,40.64 72.39,41.91 ULPI1.13
  Bottom 0.254: X1.22 35.56,41.91 54.61,41.91 v58.42,38.1
ULPI1_D7  (via drill 0.61)
  Top 0.254: v58.42,46.99 72.39,46.99 ULPI1.15
  Bottom 0.254: X1.24 35.56,46.99 v58.42,46.99
ULPI1_DIR  (via drill 0.61)
  Top 0.254: v71.12,41.91 v58.42,41.91
  Bottom 0.254: X1.21 57.15,43.18 v58.42,41.91 | v71.12,41.91 74.93,41.91 ULPI1.12
ULPI1_NXT  (via drill 0.61)
  Top 0.254: v58.42,45.72 71.12,45.72 72.39,44.45 74.93,44.45 ULPI1.14
  Bottom 0.254: v58.42,45.72 X1.23
ULPI1_RST  (via drill 0.61)
  Top 0.254: v55.88,38.1 58.42,40.64 v66.04,40.64
  Bottom 0.254: v55.88,38.1 X1.17 | v66.04,40.64 72.39,34.29 74.93,34.29 ULPI1.8
ULPI1_STP
  Bottom 0.254: X1.25 58.42,48.26 58.42,50.8 60.96,53.34 66.04,53.34 72.39,46.99 74.93,46.99 ULPI1.16
ULPI2_CLK  (via drill 0.61)
  Top 0.254: X1.34 35.56,59.69 v53.34,59.69
  Bottom 0.254: v53.34,59.69 60.96,59.69 62.23,60.96 67.31,60.96 72.39,66.04 74.93,66.04 ULPI2.10
ULPI2_D0
  Top 0.254: X1.26 35.56,46.99 46.99,46.99 57.15,57.15 ULPI2.1
ULPI2_D1
  Top 0.254: X1.27 48.26,50.8 57.15,59.69 ULPI2.3
ULPI2_D2
  Top 0.254: X1.28 35.56,49.53 48.26,49.53 57.15,58.42 74.93,58.42 74.93,60.96 ULPI2.5
ULPI2_D3
  Top 0.254: X1.31 52.07,55.88 57.15,60.96 69.85,60.96 ULPI2.7
ULPI2_D4
  Top 0.254: X1.33 53.34,58.42 57.15,62.23 68.58,62.23 ULPI2.9
ULPI2_D5
  Top 0.254: X1.35 54.61,60.96 57.15,63.5 67.31,63.5 ULPI2.11
ULPI2_D6
  Top 0.254: X1.37 55.88,63.5 57.15,64.77 66.04,64.77 ULPI2.13
ULPI2_D7
  Top 0.254: X1.39 64.77,66.04 ULPI2.15
ULPI2_DIR  (via drill 0.61)
  Top 0.254: X1.36 35.56,62.23 v54.61,62.23
  Bottom 0.254: v54.61,62.23 66.04,62.23 72.39,68.58 74.93,68.58 ULPI2.12
ULPI2_NXT  (via drill 0.61)
  Top 0.254: X1.38 35.56,64.77 v55.88,64.77
  Bottom 0.254: v55.88,64.77 58.42,64.77 64.77,71.12 74.93,71.12 ULPI2.14
ULPI2_RST
  Bottom 0.254: X1.32 35.56,54.61 49.53,54.61 53.34,50.8 55.88,50.8 55.88,53.34 62.23,59.69 68.58,59.69 72.39,63.5 74.93,63.5 ULPI2.8
ULPI2_STP  (via drill 0.61)
  Top 0.254: X1.40 35.56,67.31 64.77,67.31 v71.12,73.66
  Bottom 0.254: v71.12,73.66 74.93,73.66 ULPI2.16
VCC-BAT
  Top 0.254: 135.89,5.08 BATTERY.2 | 97.79,17.78 R1.1 | 116.84,20.32 C2.1 | 104.14,17.78 C3.2 | 110.49,20.32 R2.2 | 129.54,20.32 R6.2 | 123.19,20.32 R3.2
  Top 0.406: U2.8 114.3,13.68 114.3,20.32
  Top 1.422: 135.89,20.32 C1.1
  Top 1.676: 135.89,5.08 BAT.TP 135.89,13.97 138.43,16.51 138.43,19.05 137.16,20.32 135.89,20.32 129.54,20.32 123.19,20.32 116.84,20.32 114.3,20.32 110.49,20.32 106.68,20.32 104.14,17.78 97.79,17.78
XBEE-4
  Top 0.254: X3.12 86.36,93.98 60.96,93.98 58.88,96.06 U1.4
XBEE-5  (via drill 0.61)
  Top 0.254: v80.01,97.79 58.42,97.79 57.15,96.52 U1.5
  Bottom 0.254: X3.10 v80.01,97.79
XBEE-6
  Bottom 0.254: U1.6 56.58,97.79 77.47,97.79 X3.8
XBEE-9  (via drill 0.61)
  Top 0.254: U1.9 52.26,92.71 v67.31,92.71
  Bottom 0.254: v67.31,92.71 69.85,95.25 77.47,95.25 X3.6
XBEE-11
  Top 0.254: U1.11 64.23,91.44 71.12,91.44 72.39,92.71 X3.2
XBEE-13
  Top 0.254: U1.13 66.96,90.17 72.39,90.17 73.66,91.44 76.2,91.44 X3.4
XBEE-14
  Top 0.254: U1.14 67.69,88.9 73.66,88.9 X3.1
XBEE-15
  Bottom 0.254: X3.3 77.47,78.74 59.53,78.74 U1.15
XBEE-17
  Top 0.254: U1.17 72.42,87.63 77.47,87.63 X3.5
XBEE-18
  Top 0.254: U1.18 73.15,86.36 78.74,86.36 X3.7
XBEE-19
  Top 0.254: U1.19 73.88,85.09 80.01,85.09 X3.9
XBEE-20
  Top 0.254: U1.20 74.61,83.82 81.28,83.82 X3.11
XBEE-CTS
  Top 0.254: X2.35 29.21,69.85 44.64,69.85 U1.12
XBEE-RTS
  Top 0.254: X2.33 30.48,68.58 51.37,68.58 U1.16
XBEE-RX  (via drill 0.61)
  Top 0.254: X2.37 36.83,80.01 v46.99,80.01
  Bottom 0.254: v46.99,80.01 62.88,95.9 U1.2
XBEE-TX  (via drill 0.61)
  Top 0.254: v46.07,81.28 35.56,81.28 X2.39
  Bottom 0.254: v46.07,81.28 U1.3
(copper drawn outside any net)
  shapes: Bottom area x1

### Text on the board
tNames: Bumblebee 11/2014 | Y. Groner / D. Klitzke / C. Löser | H. Heinisch / S. Krais / C. Müller | + | + | GND | GND | + | GND | + | +